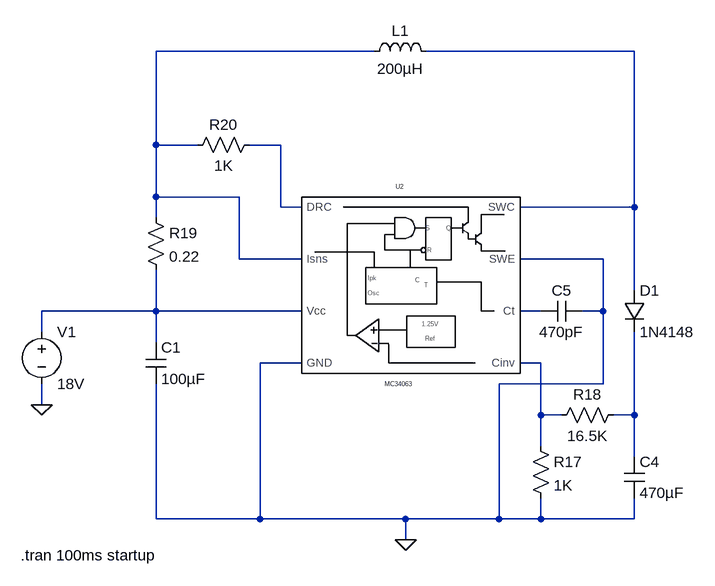
[diagram p0: schematic MC34063_Test.asc]
MC34063_Test.asc, the LTspice schematic file:
Version 4
SHEET 1 2712 2204
WIRE -1568 -1024 -1904 -1024
WIRE -1168 -1024 -1488 -1024
WIRE -1904 -880 -1904 -1024
WIRE -1840 -880 -1904 -880
WIRE -1712 -880 -1760 -880
WIRE -1904 -800 -1904 -880
WIRE -1776 -800 -1904 -800
WIRE -1712 -784 -1712 -880
WIRE -1680 -784 -1712 -784
WIRE -1168 -784 -1168 -1024
WIRE -1168 -784 -1344 -784
WIRE -1904 -768 -1904 -800
WIRE -1776 -704 -1776 -800
WIRE -1680 -704 -1776 -704
WIRE -1216 -704 -1344 -704
WIRE -1168 -656 -1168 -784
WIRE -1904 -624 -1904 -688
WIRE -1904 -624 -2080 -624
WIRE -1680 -624 -1904 -624
WIRE -1312 -624 -1344 -624
WIRE -1216 -624 -1216 -704
WIRE -1216 -624 -1248 -624
WIRE -2080 -592 -2080 -624
WIRE -1904 -576 -1904 -624
WIRE -1680 -544 -1744 -544
WIRE -1312 -544 -1344 -544
WIRE -1216 -512 -1216 -624
WIRE -1216 -512 -1376 -512
WIRE -2080 -480 -2080 -512
WIRE -1312 -464 -1312 -544
WIRE -1280 -464 -1312 -464
WIRE -1168 -464 -1168 -592
WIRE -1168 -464 -1200 -464
WIRE -1312 -416 -1312 -464
WIRE -1168 -400 -1168 -464
WIRE -1904 -304 -1904 -512
WIRE -1744 -304 -1744 -544
WIRE -1744 -304 -1904 -304
WIRE -1520 -304 -1744 -304
WIRE -1376 -304 -1376 -512
WIRE -1376 -304 -1520 -304
WIRE -1312 -304 -1312 -336
WIRE -1312 -304 -1376 -304
WIRE -1168 -304 -1168 -336
WIRE -1168 -304 -1312 -304
WIRE -1520 -272 -1520 -304
FLAG -1520 -272 0
FLAG -2080 -480 0
SYMBOL cap -1920 -576 R0
SYMATTR InstName C1
SYMATTR Value 100µF
SYMBOL cap -1184 -400 R0
SYMATTR InstName C4
SYMATTR Value 470µF
SYMBOL res -1328 -432 R0
SYMATTR InstName R17
SYMATTR Value 1K
SYMBOL res -1920 -784 R0
SYMATTR InstName R19
SYMATTR Value 0.22
SYMBOL ind -1584 -1008 R270
WINDOW 0 32 56 VTop 2
WINDOW 3 5 56 VBottom 2
SYMATTR InstName L1
SYMATTR Value 200µH
SYMATTR SpiceLine Ipk=0.1 Rser=3.612 Rpar=14130 Cpar=0 mfg="Coilcraft" pn="LPO4812-154"
SYMBOL cap -1312 -608 R270
WINDOW 0 32 32 VTop 2
WINDOW 3 0 32 VBottom 2
SYMATTR InstName C5
SYMATTR Value 470pF
SYMBOL res -1744 -896 R90
WINDOW 0 0 56 VBottom 2
WINDOW 3 32 56 VTop 2
SYMATTR InstName R20
SYMATTR Value 1K
SYMBOL MC34063 -1440 -688 R0
SYMATTR InstName U2
SYMBOL res -1184 -480 R90
WINDOW 0 0 56 VBottom 2
WINDOW 3 32 56 VTop 2
SYMATTR InstName R18
SYMATTR Value 16.5K
SYMBOL voltage -2080 -608 R0
WINDOW 123 0 0 Left 2
WINDOW 39 0 0 Left 2
SYMATTR InstName V1
SYMATTR Value 18V
SYMBOL diode -1184 -656 R0
SYMATTR InstName D1
SYMATTR Value 1N4148
TEXT -2112 -248 Left 2 !.tran 100ms startup

The netlist it stands for:
* MC34063_Test.asc
C1 N004 0 100µF
C4 N007 0 470µF
R17 N006 0 1K
R19 N001 N004 0.22
L1 N001 N002 200µH Ipk=0.1 Rser=3.612 Rpar=14130 Cpar=0 mfg="Coilcraft" pn="LPO4812-154"
C5 N005 0 470pF
R20 N003 N001 1K
XU2 N002 0 N005 0 N006 N004 N001 N003 MC34063  ; pins SWC SWE Ct GND Cinv Vcc Isns DRC
R18 N007 N006 16.5K
V1 N004 0 18V
D1 N002 N007 1N4148
.model D D
.lib standard.dio
.tran 100ms startup
.lib .\MC34063.lib
.backanno
.end